# Altium project badgotron.PrjPcb
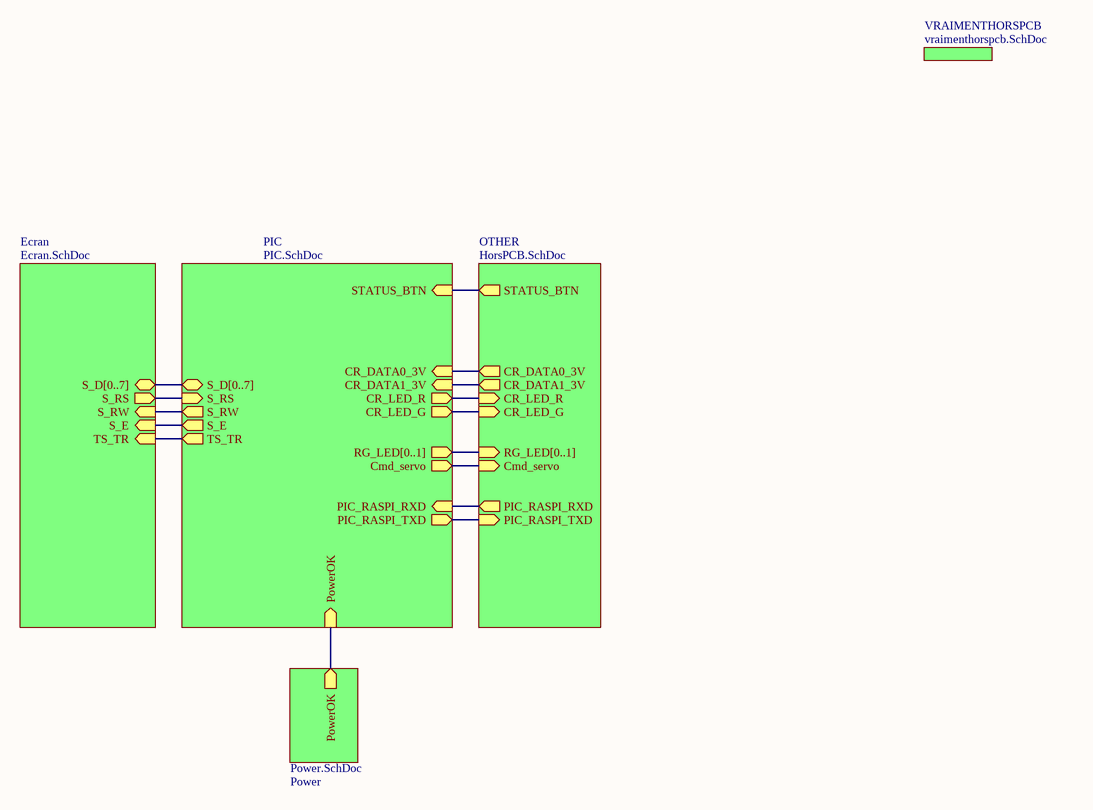
[diagram p0: Main.SchDoc]
6 sheets, 66 parts. Net scope: hierarchical (ports join the sheet entries above them; power ports are global).
Board files: PCB1.PcbDoc, PCB2.PcbDoc, PCB3.PcbDoc, PCB4.PcbDoc, PCB5.PcbDoc
Sheets:
  Main.SchDoc
    VRAIMENTHORSPCB = vraimenthorspcb.SchDoc
    Ecran = Ecran.SchDoc
    PIC = PIC.SchDoc
    OTHER = HorsPCB.SchDoc
    Power = Power.SchDoc

## Sheet Main.SchDoc
size A4

### Sub-sheets
Ecran = Ecran.SchDoc: S_D[0..7] (bidir), S_RS (out), S_RW (in), S_E (in), TS_TR (in)
OTHER = HorsPCB.SchDoc: CR_DATA0_3V (out), CR_DATA1_3V (out), CR_LED_R (in), CR_LED_G (in), RG_LED[0..1] (in), Cmd_servo (in), PIC_RASPI_TXD (in), PIC_RASPI_RXD (out), STATUS_BTN (out)
PIC = PIC.SchDoc: CR_DATA0_3V (in), CR_DATA1_3V (in), CR_LED_R (out), CR_LED_G (out), RG_LED[0..1] (out), Cmd_servo (out), PowerOK (in), S_RS (in), S_RW (out), S_E (out), TS_TR (out), S_D[0..7] (bidir), PIC_RASPI_RXD (in), PIC_RASPI_TXD (out), STATUS_BTN (in)
Power = Power.SchDoc: PowerOK (out)
VRAIMENTHORSPCB = vraimenthorspcb.SchDoc: no entries

### Nets
Cmd_servo: sheet PIC/Cmd_servo, sheet OTHER/Cmd_servo
CR_DATA0_3V: sheet PIC/CR_DATA0_3V, sheet OTHER/CR_DATA0_3V
CR_DATA1_3V: sheet PIC/CR_DATA1_3V, sheet OTHER/CR_DATA1_3V
CR_LED_G: sheet PIC/CR_LED_G, sheet OTHER/CR_LED_G
CR_LED_R: sheet PIC/CR_LED_R, sheet OTHER/CR_LED_R
PIC_RASPI_RXD: sheet PIC/PIC_RASPI_RXD, sheet OTHER/PIC_RASPI_RXD
PIC_RASPI_TXD: sheet PIC/PIC_RASPI_TXD, sheet OTHER/PIC_RASPI_TXD
PowerOK: sheet PIC/PowerOK, sheet Power/PowerOK
S_E: sheet Ecran/S_E, sheet PIC/S_E
S_RS: sheet Ecran/S_RS, sheet PIC/S_RS
S_RW: sheet Ecran/S_RW, sheet PIC/S_RW
STATUS_BTN: sheet PIC/STATUS_BTN, sheet OTHER/STATUS_BTN
TS_TR: sheet Ecran/TS_TR, sheet PIC/TS_TR

### Buses and harness runs
bus sheet Ecran/S_D[0..7] = sheet PIC/S_D[0..7]
bus sheet OTHER/RG_LED[0..1] = sheet PIC/RG_LED[0..1]

## Sheet vraimenthorspcb.SchDoc
size A
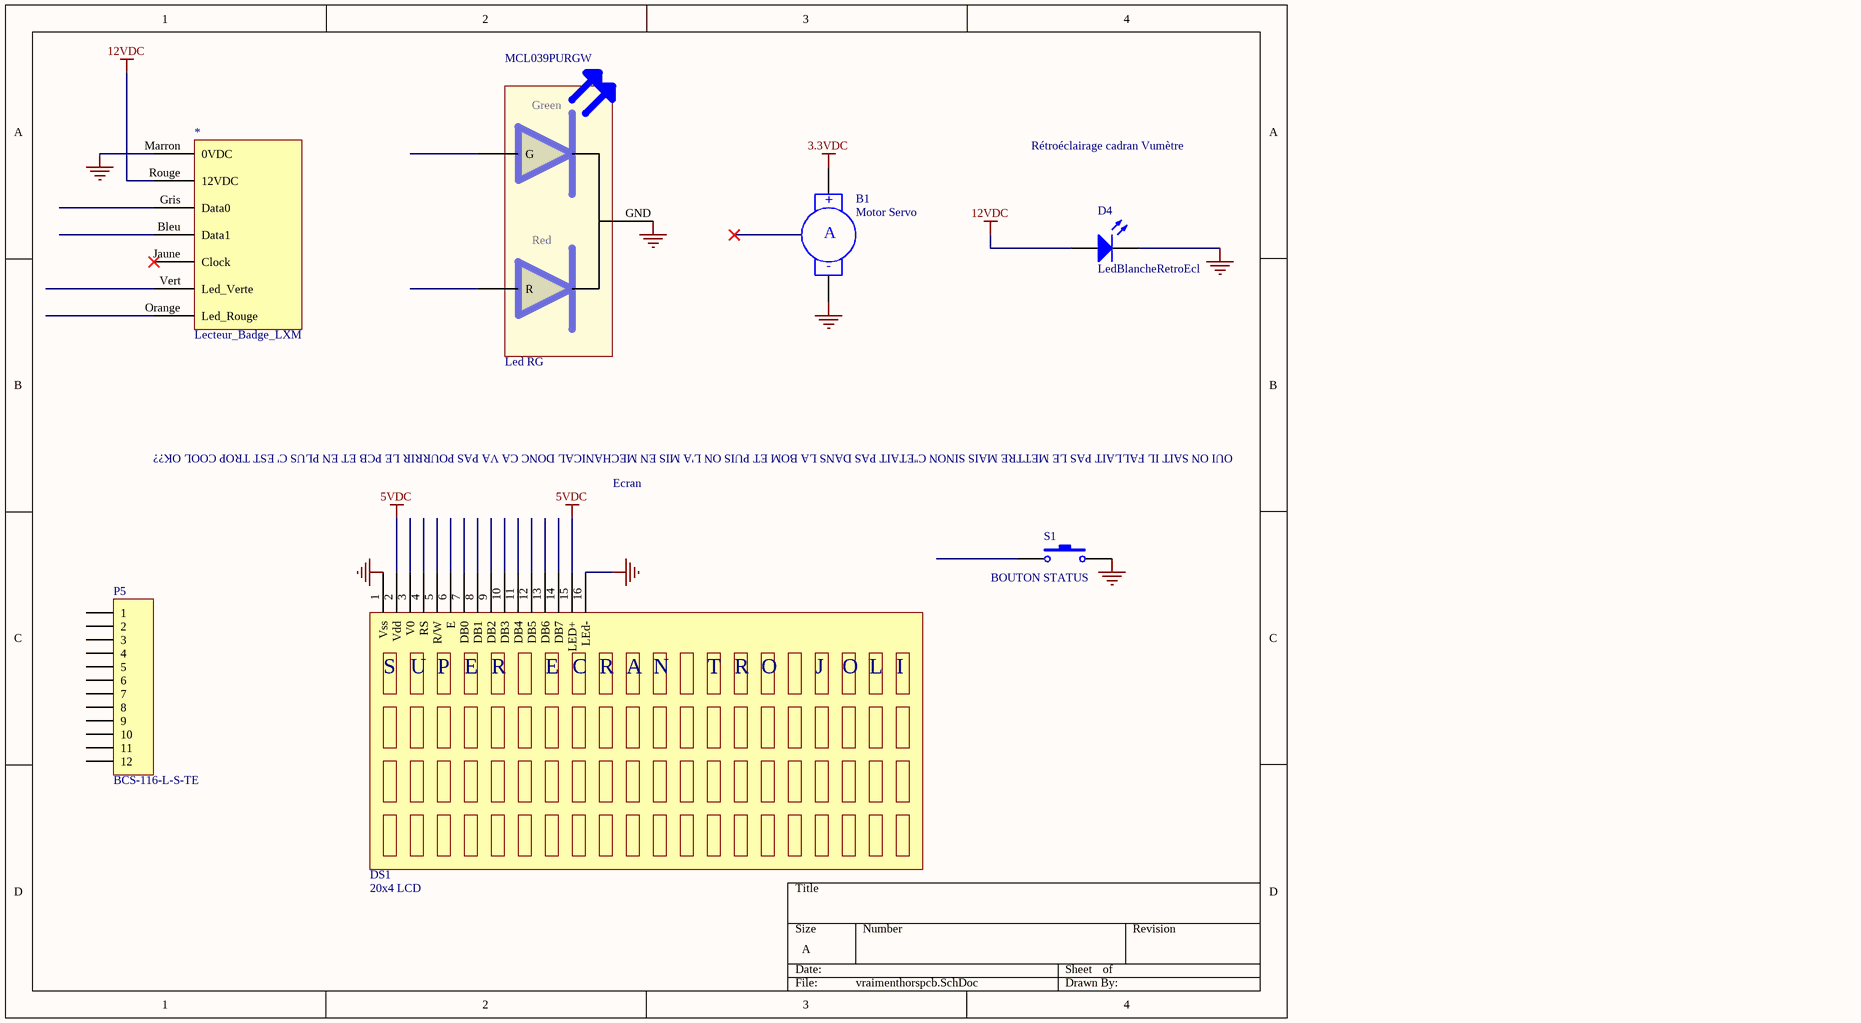
[diagram p1: vraimenthorspcb.SchDoc]

### Parts
*  Lecteur_Badge_LXM  (mechanical)
B1  Motor Servo  [RAD-0.4]  (mechanical)
D4  LedBlancheRetroEcl  [LED-0]  (mechanical)
DS1  20x4 LCD  (mechanical)
MCL039PURGW  Led RG  (mechanical)
P5  BCS-116-L-S-TE  [HDR1X12]  (mechanical)
S1  Bouton Status  [SPST-2]  (value not drawn)

### Nets
3.3VDC: B1.1(+)  [project net Vout3.3]
5VDC: DS1.2(Vdd) DS1.15(LED+)
12VDC: *.Rouge(12VDC) D4.1(A)
GND: *.Marron(0VDC) B1.2(-) D4.2(K) DS1.1(Vss) DS1.16(LEd-) MCL039PURGW.GND S1.2

Not connected (* = marked no-connect by the designer): * Bleu(Data1) Gris(Data0) Jaune(Clock)* Orange(Led_Rouge) Vert(Led_Verte); DS1 3(V0) 4(RS) 5(R/W) 6(E) 7(DB0) 8(DB1) 9(DB2) 10(DB3) 11(DB4) 12(DB5) 13(DB6) 14(DB7); MCL039PURGW G R; P5 1 2 3 4 5 6 7 8 9 10 11 12; S1 1

### Notes on the sheet
- Rétroéclairage cadran Vumètre
- Ecran
- OUI ON SAIT IL FALLAIT PAS LE METTRE MAIS SINON C''ETAIT PAS DANS LA BOM ET PUIS ON L'A MIS EN MECHANICAL DONC CA VA PAS POURRIR LE PCB ET EN PLUS C' EST TROP COOL OK??
- (near S1) BOUTON STATUS
- (in symbol MC42008A6W-FPTLW) S; U; P; R; C; A; N; T; O; J; L; I
- (in symbol MCL039PURGW) Green; Red
- (in symbol Motor Servo) A

### Library data of the parts
* = Lecteur_Badge_LXM: Fournisseur: Gregoire; Fabricant: Stid-Security; Ref.Fournisseur: :); Ref.Fabricant: LXM_WIEGAND44b
B1 = Motor Servo: Servo Motor; Fournisseur: Olimex; Ref.Fournisseur: MS-R-1.3-9; Fabricant: Olimex; Ref.Fabricant: MS-R-1.3-9
D4 = LED0: LED Blanche retro vumetre; Fournisseur: BARBIE; Fabricant: N/A; Ref.Fabricant: N/A; Ref.Fournisseur: N/A
DS1 = MC42008A6W-FPTLW: Fournisseur: Farnell; Ref.Fournisseur: 2606880; Fabricant: Midas; Ref.Fabricant: MC42008A6W-FPTLW
MCL039PURGW = MCL039PURGW: Fournisseur: Farnell; Fabricant: Multicomp; Ref.Fournisseur: 1581194; Ref.Fabricant: MCL039PURGW
P5 = Header 12: Header, 12-Pin; Fournisseur: Farnell; Ref.Fournisseur: 1667483; Fabricant: Samtec; Ref.Fabricant: BCS-116-L-S-TE
S1 = SW-PB: Switch; Fournisseur: Farnell; Fabricant: RAFI; Ref.Fabricant: 1.10.001.001/0205; Ref.Fournisseur: 9927360

## Sheet Ecran.SchDoc
size A
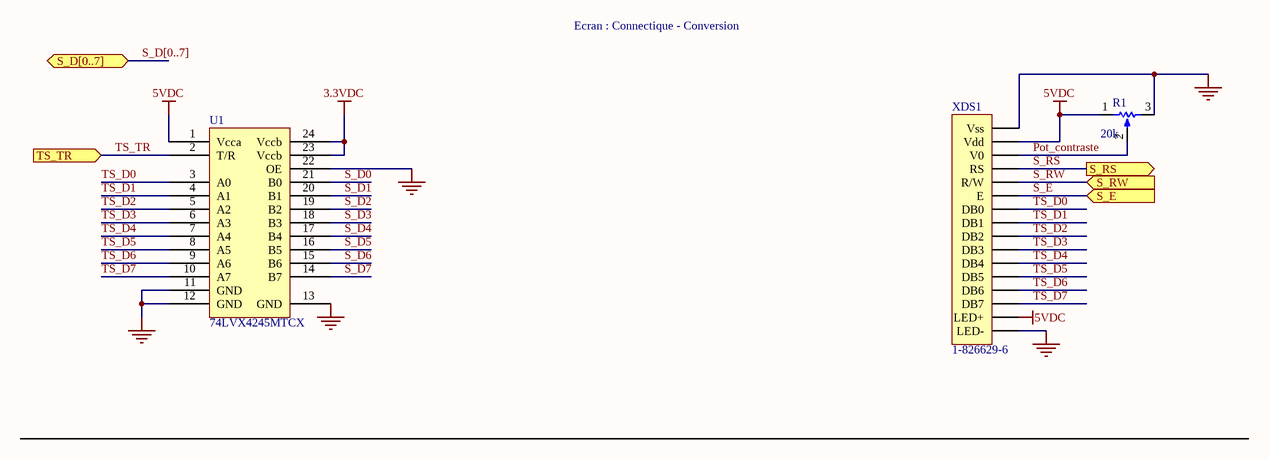
[diagram p2: Ecran.SchDoc]

### Parts
R1  20k  [POTARD]
U1  74LVX4245MTCX  [TRANS]
XDS1  1-826629-6  [HDR1X16]

### Ports
S_D[0..7] (bidir), S_E (in), S_RS (out), S_RW (in), TS_TR (in)

### Nets
3.3VDC: U1.23(Vccb) U1.24(Vccb)  [project net Vout3.3]
5VDC: R1.1(TOP) U1.1(Vcca) XDS1.2(Vdd) XDS1.15(LED+)
GND: R1.3(BOT) U1.11(GND) U1.12(GND) U1.13(GND) U1.22(OE) XDS1.1(Vss) XDS1.16(LED-)
Pot_contraste: R1.2(TAP) XDS1.3(V0)
S_D0: U1.21(B0)
S_D1: U1.20(B1)
S_D2: U1.19(B2)
S_D3: U1.18(B3)
S_D4: U1.17(B4)
S_D5: U1.16(B5)
S_D6: U1.15(B6)
S_D7: U1.14(B7)
S_E: XDS1.6(E) ; port S_E
S_RS: XDS1.4(RS) ; port S_RS
S_RW: XDS1.5(R/W) ; port S_RW
TS_D0: U1.3(A0) XDS1.7(DB0)
TS_D1: U1.4(A1) XDS1.8(DB1)
TS_D2: U1.5(A2) XDS1.9(DB2)
TS_D3: U1.6(A3) XDS1.10(DB3)
TS_D4: U1.7(A4) XDS1.11(DB4)
TS_D5: U1.8(A5) XDS1.12(DB5)
TS_D6: U1.9(A6) XDS1.13(DB6)
TS_D7: U1.10(A7) XDS1.14(DB7)
TS_TR: U1.2(T/R) ; port TS_TR

### Buses and harness runs
bus S_D[0..7] = port S_D[0..7]

### Notes on the sheet
- Ecran : Connectique - Conversion

### Library data of the parts
R1 = RPot: Potentiometer; Fournisseur: Farnell; Ref.Fournisseur: 9609822; Ref.Fabricant: M63S203KB40; Fabricant: VISHAY
U1 = 74LVX4245MTCX: Bus Transceiver; Fabricant: ON SEMICONDUCTOR; Fournisseur: Farnell; Ref.Fournisseur: 1467357; Ref.Fabricant: 74LVX4245MTCX
XDS1 = Header 16: Header, 16-Pin; Fournisseur: Farnell; Fabricant: AMP-TE CONNECTIVITY; Ref.Fournisseur: 1248124; Ref.Fabricant: 1-826629-6

## Sheet PIC.SchDoc
size A4
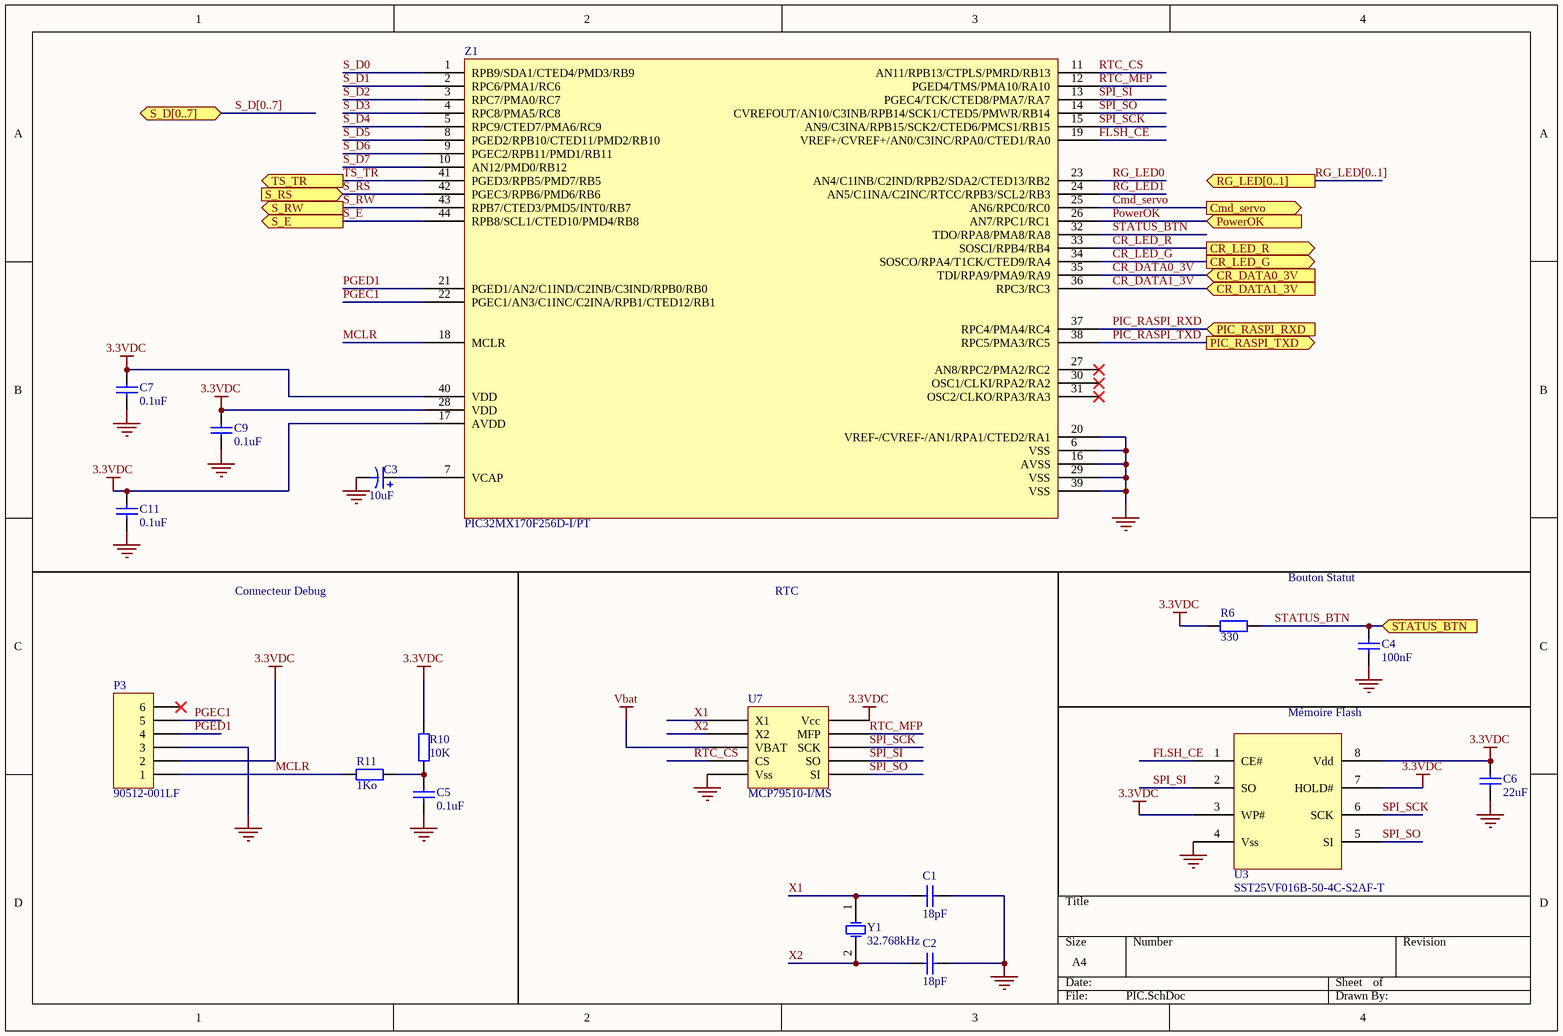
[diagram p3: PIC.SchDoc]

### Parts
C1  18pF  [0603]
C2  18pF  [0603]
C3  10uF  [C3]
C4  100nF  [0603]
C5  0.1uF  [0603]
C6  22uF  [0603]
C7  0.1uF  [0603]
C9  0.1uF  [0603]
C11  0.1uF  [0603]
P3  90512-001LF  [RJ12]
R6  330  [0603]
R10  10K  [0603]
R11  1Ko  [0603]
U3  SST25VF016B-50-4C-S2AF-T  [FLASH]
U7  MCP79510-I/MS  [rtc]
Y1  32.768kHz  [QUARTZ32KHz]
Z1  PIC32MX170F256D-I/PT  [TQFP-44_L]

### Ports
Cmd_servo (out), CR_DATA0_3V (in), CR_DATA1_3V (in), CR_LED_G (out), CR_LED_R (out), PIC_RASPI_RXD (in), PIC_RASPI_TXD (out), PowerOK (in), RG_LED[0..1] (out), S_D[0..7] (bidir), S_E (out), S_RS (in), S_RW (out), STATUS_BTN (in), TS_TR (out)

### Nets
3.3VDC: C6.2 C7.1 C9.1 C11.1 P3.2 R6.1 R10.2 U3.3(WP#) U3.7(HOLD#) U3.8(Vdd) U7.10(Vcc) Z1.17(AVDD) Z1.28(VDD) Z1.40(VDD)  [project net Vout3.3]
GND: C1.1 C2.1 C3.2 C4.1 C5.1 C6.1 C7.2 C9.2 C11.2 P3.3 U3.4(Vss) U7.5(Vss) Z1.6(VSS) Z1.16(AVSS) Z1.20(VREF-/CVREF-/AN1/RPA1/CTED2/RA1) Z1.29(VSS) Z1.39(VSS)
Vbat: U7.3(VBAT)
Cmd_servo: Z1.25(AN6/RPC0/RC0) ; port Cmd_servo
CR_DATA0_3V: Z1.35(TDI/RPA9/PMA9/RA9) ; port CR_DATA0_3V
CR_DATA1_3V: Z1.36(RPC3/RC3) ; port CR_DATA1_3V
CR_LED_G: Z1.34(SOSCO/RPA4/T1CK/CTED9/RA4) ; port CR_LED_G
CR_LED_R: Z1.33(SOSCI/RPB4/RB4) ; port CR_LED_R
FLSH_CE: U3.1(CE#) Z1.19(VREF+/CVREF+/AN0/C3INC/RPA0/CTED1/RA0)
MCLR: P3.1 R11.2 Z1.18(MCLR)
PGEC1: P3.5 Z1.22(PGEC1/AN3/C1INC/C2INA/RPB1/CTED12/RB1)
PGED1: P3.4 Z1.21(PGED1/AN2/C1IND/C2INB/C3IND/RPB0/RB0)
PIC_RASPI_RXD: Z1.37(RPC4/PMA4/RC4) ; port PIC_RASPI_RXD
PIC_RASPI_TXD: Z1.38(RPC5/PMA3/RC5) ; port PIC_RASPI_TXD
PowerOK: Z1.26(AN7/RPC1/RC1) ; port PowerOK
RG_LED0: Z1.23(AN4/C1INB/C2IND/RPB2/SDA2/CTED13/RB2)
RG_LED1: Z1.24(AN5/C1INA/C2INC/RTCC/RPB3/SCL2/RB3)
RTC_CS: U7.4(CS) Z1.11(AN11/RPB13/CTPLS/PMRD/RB13)
RTC_MFP: U7.9(MFP) Z1.12(PGED4/TMS/PMA10/RA10)
S_D0: Z1.1(RPB9/SDA1/CTED4/PMD3/RB9)
S_D1: Z1.2(RPC6/PMA1/RC6)
S_D2: Z1.3(RPC7/PMA0/RC7)
S_D3: Z1.4(RPC8/PMA5/RC8)
S_D4: Z1.5(RPC9/CTED7/PMA6/RC9)
S_D5: Z1.8(PGED2/RPB10/CTED11/PMD2/RB10)
S_D6: Z1.9(PGEC2/RPB11/PMD1/RB11)
S_D7: Z1.10(AN12/PMD0/RB12)
S_E: Z1.44(RPB8/SCL1/CTED10/PMD4/RB8) ; port S_E
S_RS: Z1.42(PGEC3/RPB6/PMD6/RB6) ; port S_RS
S_RW: Z1.43(RPB7/CTED3/PMD5/INT0/RB7) ; port S_RW
SPI_SCK: U3.6(SCK) U7.8(SCK) Z1.15(AN9/C3INA/RPB15/SCK2/CTED6/PMCS1/RB15)
SPI_SI: U3.2(SO) U7.7(SO) Z1.13(PGEC4/TCK/CTED8/PMA7/RA7)
SPI_SO: U3.5(SI) U7.6(SI) Z1.14(CVREFOUT/AN10/C3INB/RPB14/SCK1/CTED5/PMWR/RB14)
STATUS_BTN: C4.2 R6.2 Z1.32(TDO/RPA8/PMA8/RA8) ; port STATUS_BTN
TS_TR: Z1.41(PGED3/RPB5/PMD7/RB5) ; port TS_TR
X1: C1.2 U7.1(X1) Y1.1(OSC1)
X2: C2.2 U7.2(X2) Y1.2(OSC2)
NetC3_1: C3.1 Z1.7(VCAP)
NetC5_2: C5.2 R10.1 R11.1

Not connected (* = marked no-connect by the designer): P3 6*; Z1 27(AN8/RPC2/PMA2/RC2)* 30(OSC1/CLKI/RPA2/RA2)* 31(OSC2/CLKO/RPA3/RA3)*

### Buses and harness runs
bus RG_LED[0..1] = port RG_LED[0..1]
bus S_D[0..7] = port S_D[0..7]

### Notes on the sheet
- Bouton Statut
- Connecteur Debug
- RTC
- Mémoire Flash

### Library data of the parts
C1 C2 = Cap: Capacitor; Fournisseur: Farnell; Fabricant: AVX; Ref.Fabricant: 02013A180JAT2A; Ref.Fournisseur: 1740563
C3 = Cap Pol1: Fournisseur: Farnell; Ref.Fournisseur: 2353238; Ref.Fabricant: TL3C106K025C0450..; Fabricant: VISHAY
C4 = Cap: Capacitor; Fournisseur: Farnell; Ref.Fournisseur: 2812613; Fabricant: WURTH ELECTRONIK; Ref.Fabricant: 885342211005; Value: 100nF
C5 C7 C9 C11 = Cap: Capacitor; Fournisseur: Farnell; Fabricant: Multicomp; Ref.Fabricant: MCY4C3B104M160CT; Ref.Fournisseur: 2310273; Value: 0.1uF
C6 = Cap: Cout_Reg_3.3v; Fournisseur: Farnell; Fabricant: AVX; Ref.Fabricant: 12103D226KAT2A; Ref.Fournisseur: 1833829; Value: 22uF
P3 = Header 6: PortRJ12_debug; Fournisseur: Farnell; Fabricant: Amphenol ICC; Ref.Fournisseur: 1097914; Ref.Fabricant: 90512-001LF
R6 = Res2: Resistor; Fabricant: TE Connectivity; Fournisseur: Farnell; Ref.Fabricant: RN73C1J232RBTDF; Ref.Fournisseur: 2687973
R10 = Res2: Resistor; Fournisseur: Farnell; Fabricant: TE CONNECTIVITY; Ref.Fabricant: CPF0201D10KC1; Ref.Fournisseur: 2117887; Value: 10k
R11 = Res2: Resistor; Value: 1K; Fournisseur: Farnell; Fabricant: TE CONNECTIVITY; Ref.Fabricant: CPF0201D1K0E1; Ref.Fournisseur: 2117780
U3 = Memoire: FLASH; Fournisseur: Farnell; Fabricant: Microchip; Ref.Fabricant: SST25VF016B-50-4I-S2AF-T; Ref.Fournisseur: 2774943
U7 = MCP79510: RTC; Fournisseur: Farnell; Ref.Fournisseur: 2361124; Fabricant: Microchip; Ref.Fabricant: MCP79510-I/MS
Y1 = XTAL: Crystal Oscillator; Fournisseur: Farnell; Fabricant: ABRACON; Ref.Fabricant: ABS07-32.768KHZ-7-T; Ref.Fournisseur: 1838935
Z1 = PIC32_1: PIC; Fournisseur: Farnell; Fabricant: MICROCHIP; Ref.Fournisseur: 2456845; Ref.Fabricant: PIC32MX170F256D-I/PT

## Sheet HorsPCB.SchDoc
size A4
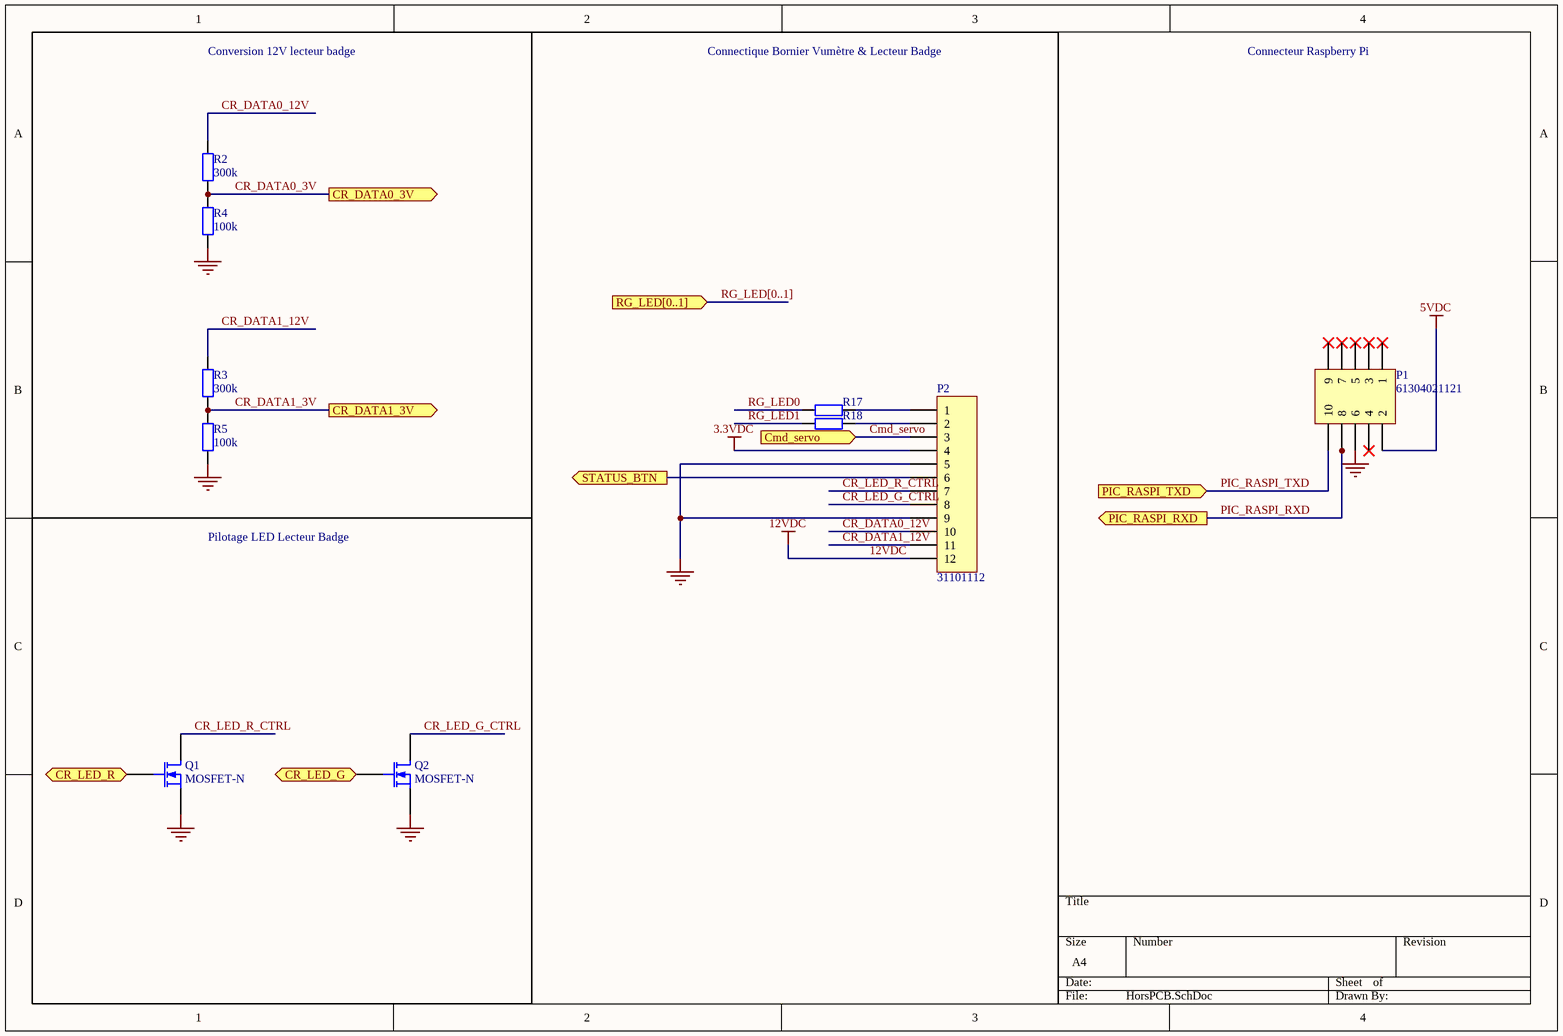
[diagram p4: HorsPCB.SchDoc]

### Parts
P1  61304021121  [HDR2X5]
P2  31101112  [Bornier12]
Q1  MOSFET-N  [nouveau_mosfetN]
Q2  MOSFET-N  [nouveau_mosfetN]
R2  300k  [0603]
R3  300k  [0603]
R4  100k  [0603]
R5  100k  [0603]
R17  60.4  [0603]  (value not drawn)
R18  75  [0603]  (value not drawn)

### Ports
Cmd_servo (in), CR_DATA0_3V (out), CR_DATA1_3V (out), CR_LED_G (in), CR_LED_R (in), PIC_RASPI_RXD (out), PIC_RASPI_TXD (in), RG_LED[0..1] (in), STATUS_BTN (out)

### Nets
3.3VDC: P2.4  [project net Vout3.3]
5VDC: P1.2
12VDC: P2.12
GND: P1.6 P2.5 P2.9 Q1.3(S) Q2.3(S) R4.1 R5.1
Cmd_servo: P2.3 ; port Cmd_servo
CR_DATA0_3V: R2.1 R4.2 ; port CR_DATA0_3V
CR_DATA0_12V: P2.10 R2.2
CR_DATA1_3V: R3.1 R5.2 ; port CR_DATA1_3V
CR_DATA1_12V: P2.11 R3.2
CR_LED_G: Q2.2(G) ; port CR_LED_G
CR_LED_G_CTRL: P2.8 Q2.1(D)
CR_LED_R: Q1.2(G) ; port CR_LED_R
CR_LED_R_CTRL: P2.7 Q1.1(D)
PIC_RASPI_RXD: P1.8 ; port PIC_RASPI_RXD
PIC_RASPI_TXD: P1.10 ; port PIC_RASPI_TXD
RG_LED0: R17.1
RG_LED1: R18.1
STATUS_BTN: P2.6 ; port STATUS_BTN
NetP2_1: P2.1 R17.2
NetP2_2: P2.2 R18.2

Not connected (* = marked no-connect by the designer): P1 1* 3* 4* 5* 7* 9*

### Buses and harness runs
bus RG_LED[0..1] = port RG_LED[0..1]

### Notes on the sheet
- Conversion 12V lecteur badge
- Connectique Bornier Vumètre & Lecteur Badge
- Connecteur Raspberry Pi
- Pilotage LED Lecteur Badge

### Library data of the parts
P1 = Header 5X2: Header, 5-Pin, Dual row; Fournisseur: Farnell; Ref.Fournisseur: 2356148; Fabricant: WURTH ELEKTRONIK; Ref.Fabricant: 61304021121
P2 = Header 12: Header, 12-Pin; Fournisseur: Farnell; Fabricant: METZ CONNECT; Ref.Fournisseur: 1909750; Ref.Fabricant: 31101112
Q1 Q2 = MOSFET-N: N-Channel MOSFET; Fournisseur: Farnell; Ref.Fournisseur: 2727912; Fabricant: ON SEMICONDUCTOR; Ref.Fabricant: 1HN04CH-TL-W
R2 R3 = Res2: Resistor; Fournisseur: Farnell; Ref.Fournisseur: 2074433; Fabricant: MULTICOMP; Ref.Fabricant: MCSR08X3003FTL; Value: 300k
R4 R5 = Res2: Resistor; Fournisseur: Farnell; Ref.Fournisseur: 2447226; Fabricant: MULTICOMP; Ref.Fabricant: MCWR06X1003FTL; Value: 100k
R17 = Res2: Resistor; Value: 60.4o; Fournisseur: Farnell; Fabricant: TE CONNECTIVITY; Ref.Fabricant: RP73PF1E60R4BTDF; Ref.Fournisseur: 2838800
R18 = Res2: Resistor; Value: 75o; Fournisseur: Farnell; Fabricant: TE CONNECTIVITY; Ref.Fabricant: CPF0805B75RE1; Ref.Fournisseur: 1697415

## Sheet Power.SchDoc
size A4
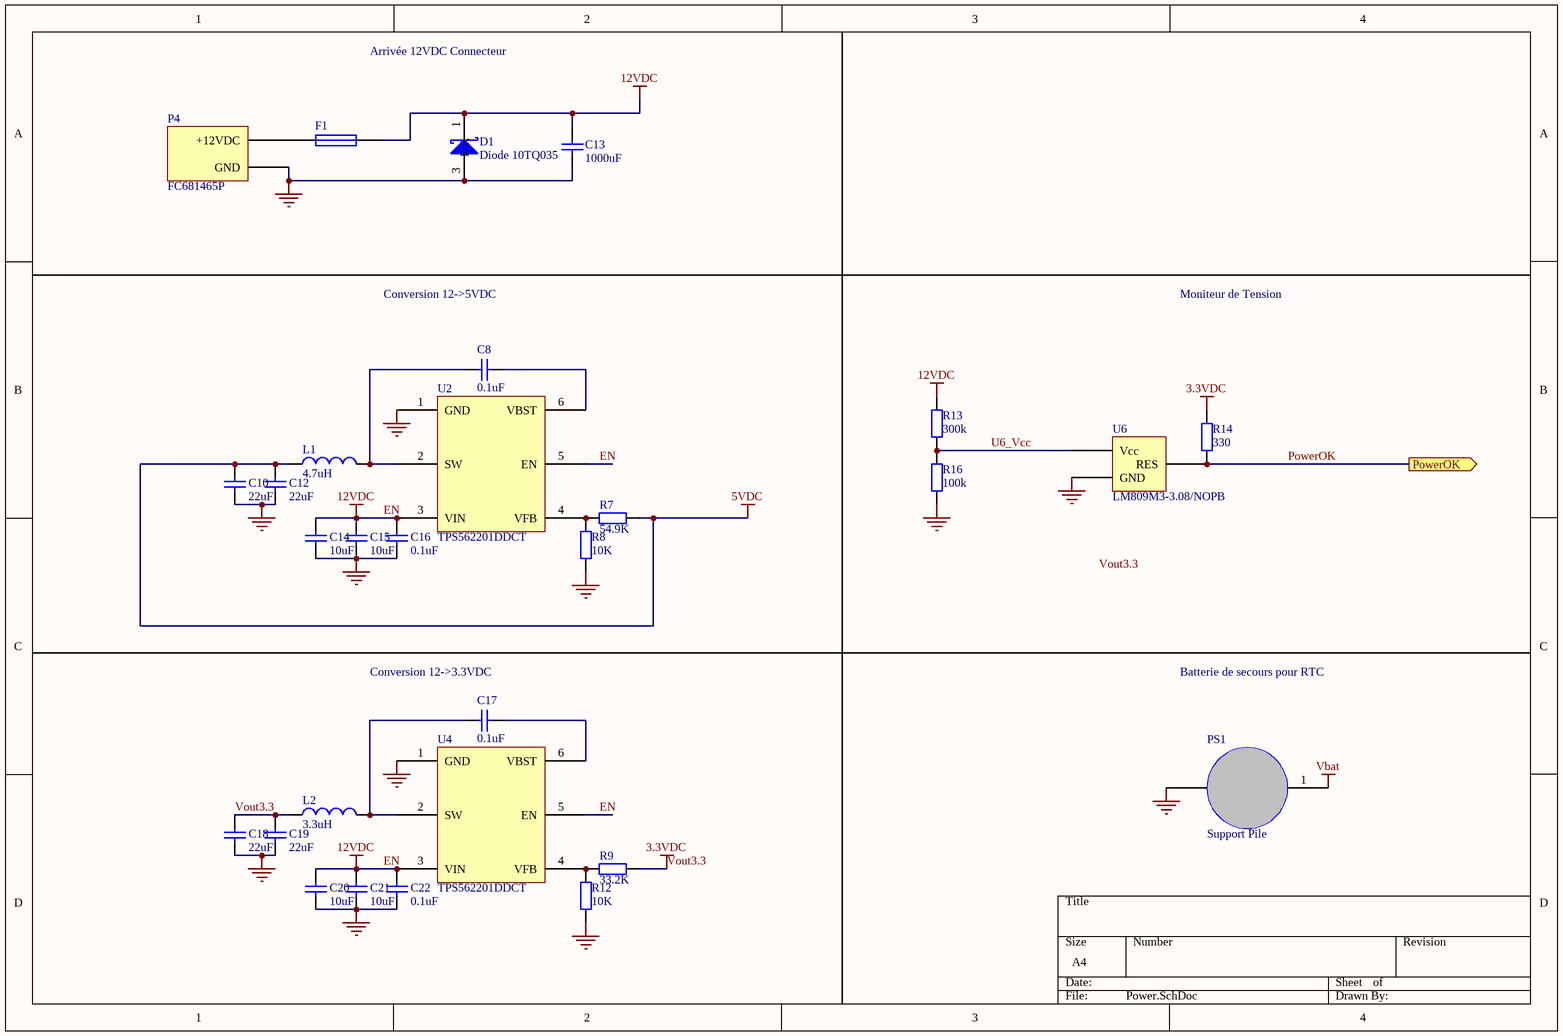
[diagram p5: Power.SchDoc]

### Parts
C8  0.1uF  [0603]
C10  22uF  [0603]
C12  22uF  [0603]
C13  1000uF  [Condo_trav]
C14  10uF  [0603]
C15  10uF  [0603]
C16  0.1uF  [0603]
C17  0.1uF  [0603]
C18  22uF  [0603]
C19  22uF  [0603]
C20  10uF  [0603]
C21  10uF  [0603]
C22  0.1uF  [0603]
D1  Diode 10TQ035  [DiodeZin]
F1  Fuse 1  [FUSIBLE]  (value not drawn)
L1  4.7uH  [Bobine Traversante 4.7]
L2  3.3uH  [Bobine Traversante 4.7]
P4  FC681465P  [JackAlim]
PS1  Support Pile  [Pile]
R7  54.9K  [0603]
R8  10K  [0603]
R9  33.2K  [0603]
R12  10K  [0603]
R13  300k  [0603]
R14  330  [0603]
R16  100k  [0603]
U2  TPS562201DDCT  [TPS562201DDCT]
U4  TPS562201DDCT  [TPS562201DDCT]
U6  LM809M3-3.08/NOPB  [LM809]

### Ports
PowerOK (out)

### Nets
5VDC: C10.1 C12.1 L1.1 R7.1
12VDC: C13.2 C14.1 C15.1 C16.1 C20.1 C21.1 C22.1 D1.1(K) F1.2 R13.2 U2.3(VIN) U2.5(EN) U4.3(VIN) U4.5(EN)  [also labelled EN]
GND: C10.2 C12.2 C13.1 C14.2 C15.2 C16.2 C18.2 C19.2 C20.2 C21.2 C22.2 D1.3(A) P4.3(GND) PS1.2(-) R8.1 R12.1 R16.1 U2.1(GND) U4.1(GND) U6.1(GND)
Vbat: PS1.1(+)
Vout3.3: C18.1 C19.1 L2.1 R9.1 R14.2  [also labelled 3.3VDC]
PowerOK: R14.1 U6.2(RES) ; port PowerOK
U6_Vcc: R13.1 R16.2 U6.3(Vcc)
NetC8_1: C8.1 L1.2 U2.2(SW)
NetC8_2: C8.2 U2.6(VBST)
NetC17_1: C17.1 L2.2 U4.2(SW)
NetC17_2: C17.2 U4.6(VBST)
NetF1_1: F1.1 P4.1(+12VDC)
NetR7_2: R7.2 R8.2 U2.4(VFB)
NetR9_2: R9.2 R12.2 U4.4(VFB)

Not connected (* = marked no-connect by the designer): P4 2(GND)

### Notes on the sheet
- Arrivée 12VDC Connecteur
- Conversion 12->5VDC
- Moniteur de Tension
- (near C17) Conversion 12->3.3VDC
- Batterie de secours pour RTC
- Labels drawn without touching a wire or pin: Vout3.3

### Library data of the parts
C8 C10 C12 C14-C22 = Cap: Reg_5v; Fournisseur: CAHIER; Fabricant: CAHIER; Ref.Fabricant: CAHIER; Ref.Fournisseur: CAHIER
  C8 C16 C17 C22: Value: 0.1uF
  C10 C12 C18 C19: Value: 22uF
  C14 C15 C20 C21: Value: 10uF
C13 = Cap: Capacitor; Ref.Fournisseur: 1902972; Fournisseur: Farnell; Fabricant: Multicomp; Ref.Fabricant: MCGLR16V108M10X16
D1 = Diode 10TQ035: Diode Zenner; Fournisseur: Farnell; Ref.Fournisseur: 2453991; Fabricant: ON SEMICONDUCTOR; Ref.Fabricant: MM3Z15VB
F1 = Fuse 1: Fuse; Fournisseur: Farnell; Ref.Fournisseur: 1596504; Fabricant: Littelfuse; Ref.Fabricant: 39515000000
L1 = Inductor: L_Reg_5v; Fabricant: BOURNS; Ref.Fabricant: RLB0914-4R7ML; Fournisseur: Farnell; Ref.Fournisseur: 2309248; Value: 4.7uH
L2 = Inductor: L_Reg_3v; Fabricant: BOURNS; Ref.Fabricant: RLB0912-3R3ML; Fournisseur: Farnell; Ref.Fournisseur: 2309234; Value: 3.3uH
P4 = FC68148S: Power connector; Fournisseur: Farnell; Ref.Fournisseur: 1854512; Fabricant: CLIFF; Ref.Fabricant: FC681465P
PS1 = SMTU-1225-1-LF: Fournisseur: Farnell; Fabricant: Renata; Ref.Fournisseur: 1216353; Ref.Fabricant: SMTU-1225-1-LF
R7 = Res2: Resistor; Fournisseur: Farnell; Fabricant: TE CONNECTIVITY; Ref.Fabricant: CPF0402B54K9E1; Ref.Fournisseur: 2330744; Value: 54.9k
R8 R12 = Res2: as R10 on sheet PIC; Value: 10k
R9 = Res2: Resistor; Fournisseur: Cahier; Value: 33.2k; Fabricant: Cahier; Ref.Fabricant: Cahier; Ref.Fournisseur: Cahier
R13 = Res2: as R2 on sheet HorsPCB; Value: 300k
R14 = Res2: as R6 on sheet PIC
R16 = Res2: as R4 on sheet HorsPCB; Value: 100k
U2 U4 = TPS562201DDCT: Reg 12V-5V; Ref.Fournisseur: 2527034; Fournisseur: Farnell; Ref.Fabricant: Texas Instrument; Fabricant: TPS562201DDCT
U6 = LM809M3-3.08/NOPB: Voltage Monitor; Fournisseur: Farnell; Ref.Fournisseur: 2352609; Fabricant: TEXAS INSTRUMENTS; Ref.Fabricant: LM809M3-3.08/NOPB

## Nets that join several sheets
5VDC: vraimenthorspcb (DS1.2 DS1.15), Ecran (R1.1 U1.1 XDS1.2 XDS1.15), HorsPCB (P1.2), Power (C10.1 C12.1 L1.1 R7.1)
12VDC: vraimenthorspcb (*.Rouge D4.1), HorsPCB (P2.12), Power (14 pins)
GND: vraimenthorspcb (7 pins), Ecran (7 pins), PIC (17 pins), HorsPCB (7 pins), Power (20 pins)
Vbat: PIC (U7.3), Power (PS1.1)
Vout3.3: vraimenthorspcb (B1.1), Ecran (U1.23 U1.24), PIC (14 pins), HorsPCB (P2.4), Power (5 pins)
Cmd_servo: PIC (Z1.25), HorsPCB (P2.3)
CR_DATA0_3V: PIC (Z1.35), HorsPCB (R2.1 R4.2)
CR_DATA1_3V: PIC (Z1.36), HorsPCB (R3.1 R5.2)
CR_LED_G: PIC (Z1.34), HorsPCB (Q2.2)
CR_LED_R: PIC (Z1.33), HorsPCB (Q1.2)
PIC_RASPI_RXD: PIC (Z1.37), HorsPCB (P1.8)
PIC_RASPI_TXD: PIC (Z1.38), HorsPCB (P1.10)
PowerOK: PIC (Z1.26), Power (R14.1 U6.2)
RG_LED0: PIC (Z1.23), HorsPCB (R17.1)
RG_LED1: PIC (Z1.24), HorsPCB (R18.1)
S_D0: Ecran (U1.21), PIC (Z1.1)
S_D1: Ecran (U1.20), PIC (Z1.2)
S_D2: Ecran (U1.19), PIC (Z1.3)
S_D3: Ecran (U1.18), PIC (Z1.4)
S_D4: Ecran (U1.17), PIC (Z1.5)
S_D5: Ecran (U1.16), PIC (Z1.8)
S_D6: Ecran (U1.15), PIC (Z1.9)
S_D7: Ecran (U1.14), PIC (Z1.10)
S_E: Ecran (XDS1.6), PIC (Z1.44)
S_RS: Ecran (XDS1.4), PIC (Z1.42)
S_RW: Ecran (XDS1.5), PIC (Z1.43)
STATUS_BTN: PIC (C4.2 R6.2 Z1.32), HorsPCB (P2.6)
TS_TR: Ecran (U1.2), PIC (Z1.41)